# Altium schematic sheet tinynano.SchDoc
size A2
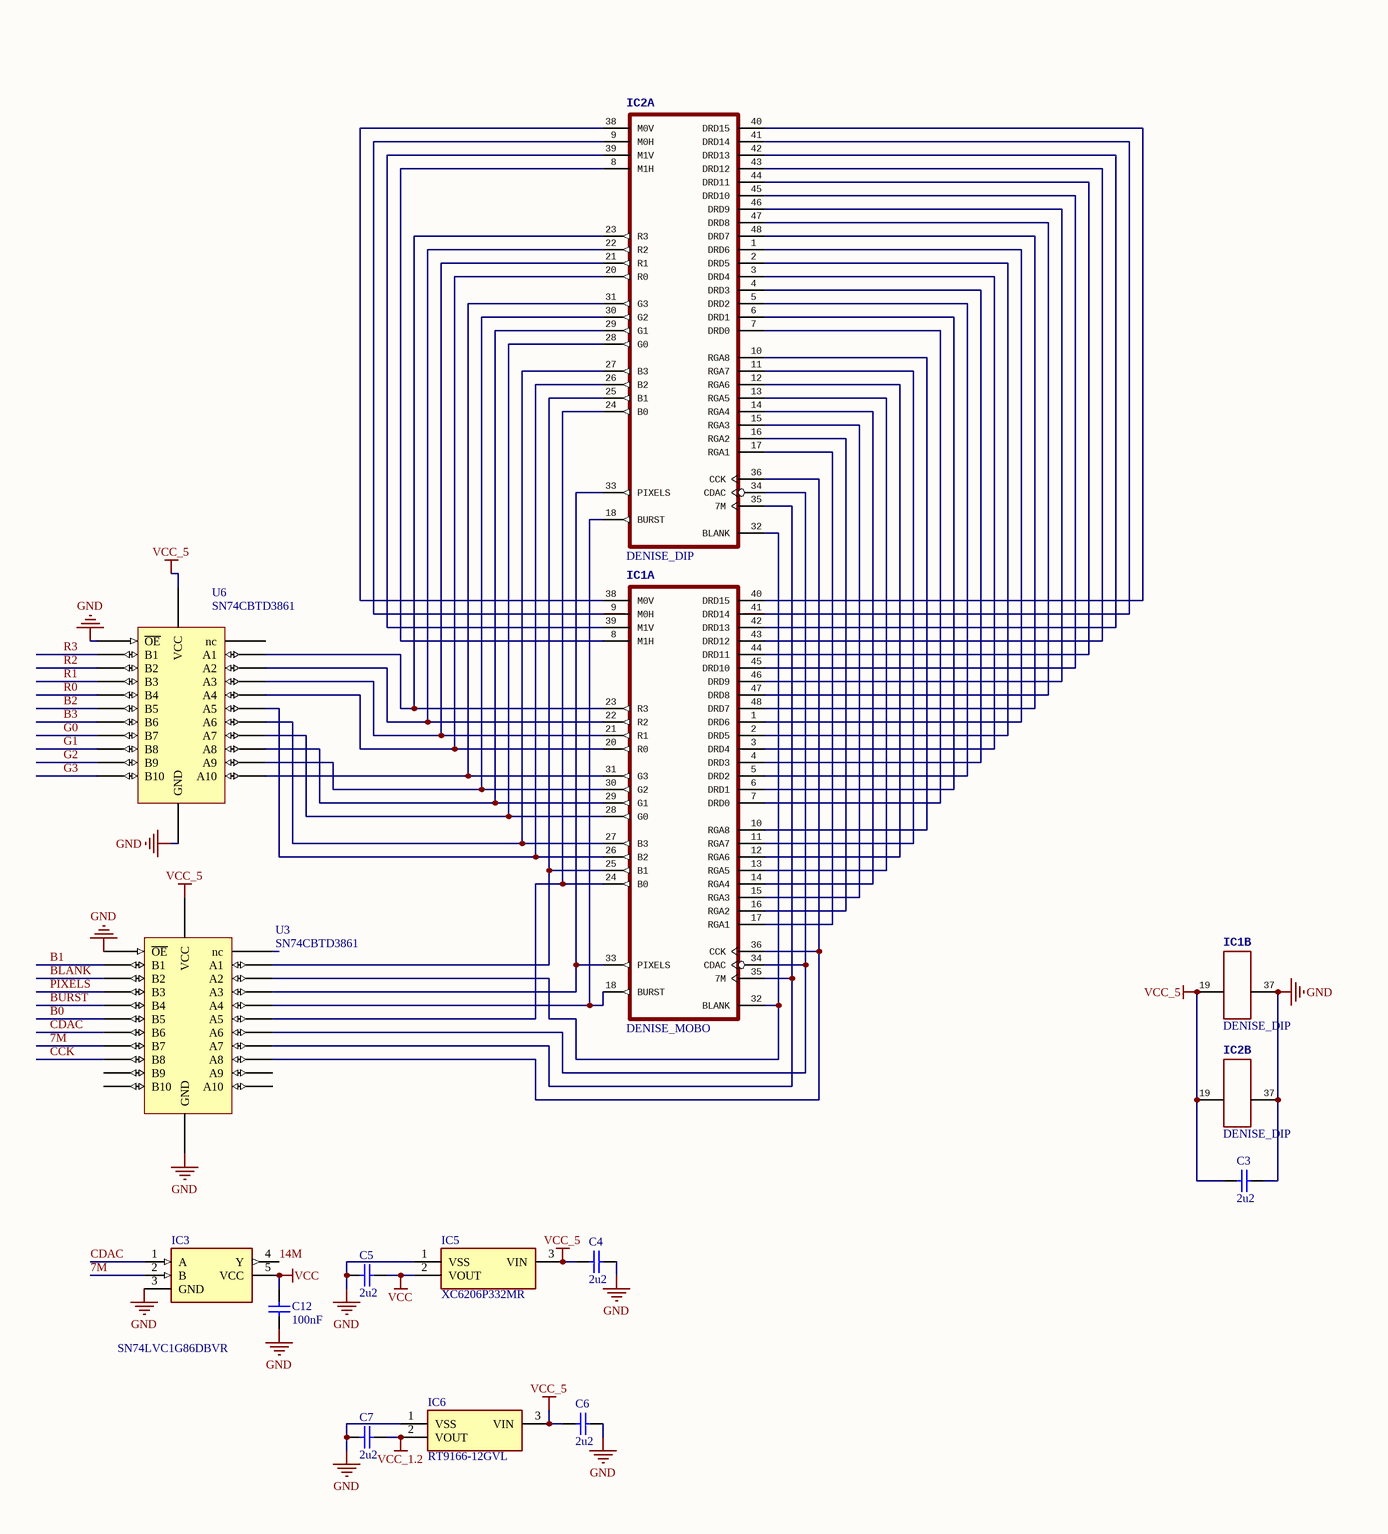
[diagram p0: tinynano.SchDoc, left]
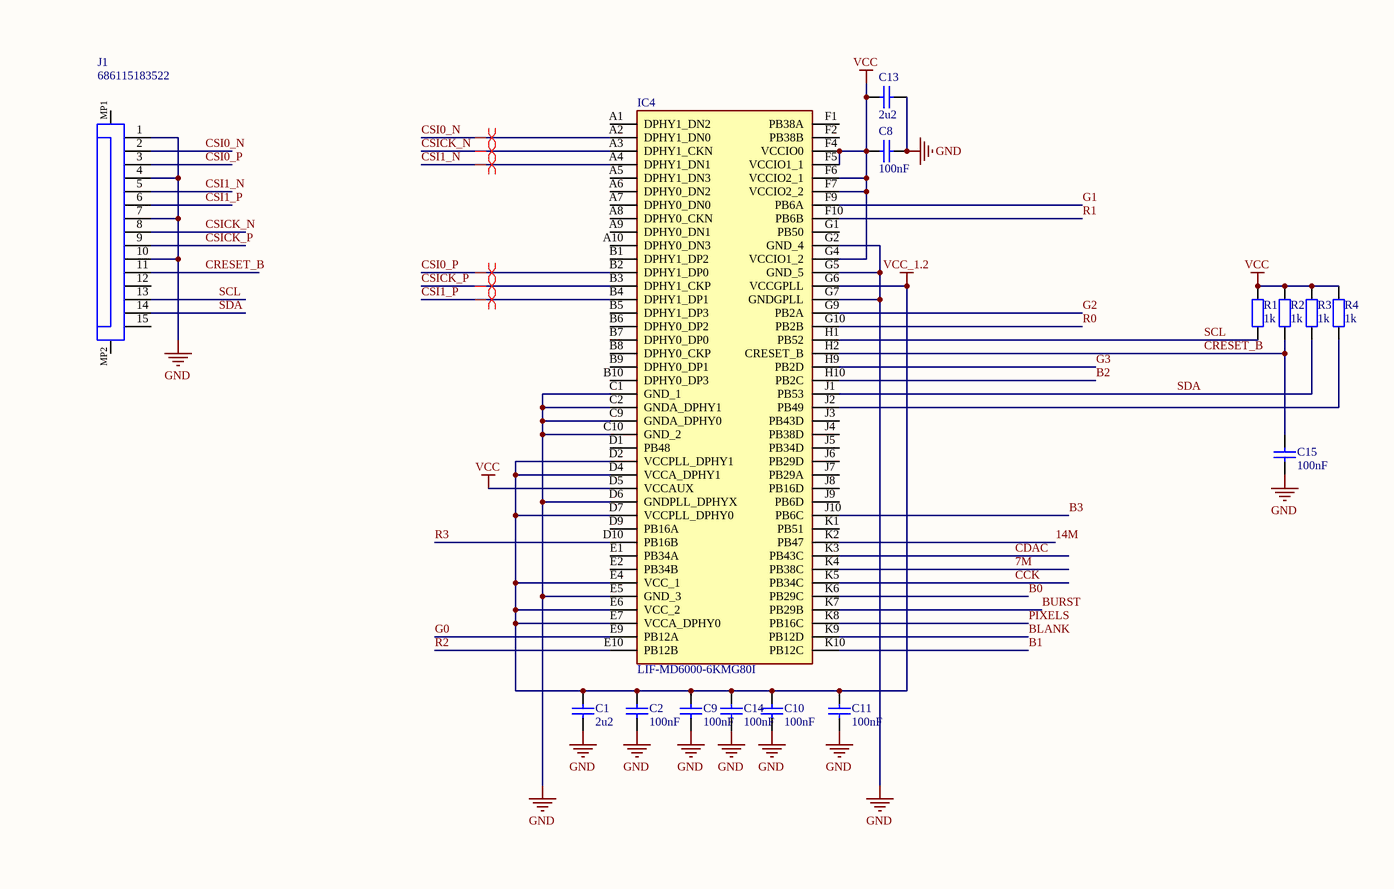
[diagram p1: tinynano.SchDoc, right]

## Parts
C1  value 2u2  [1608[0603]]  (hidden comment: Cap Semi)
C2  value 100nF  [0402]  (hidden comment: Cap Semi)
C3  value 2u2  [1608[0603]]  (hidden comment: Cap Semi)
C4  value 2u2  [1608[0603]]  (hidden comment: Cap Semi)
C5  value 2u2  [1608[0603]]  (hidden comment: Cap Semi)
C6  value 2u2  [1608[0603]]  (hidden comment: Cap Semi)
C7  value 2u2  [1608[0603]]  (hidden comment: Cap Semi)
C8  value 100nF  [0402]  (hidden comment: Cap Semi)
C9  value 100nF  [0402]  (hidden comment: Cap Semi)
C10  value 100nF  [0402]  (hidden comment: Cap Semi)
C11  value 100nF  [0402]  (hidden comment: Cap Semi)
C12  value 100nF  [0402]  (hidden comment: Cap Semi)
C13  value 2u2  [1608[0603]]  (hidden comment: Cap Semi)
C14  value 100nF  [1608[0603]]  (hidden comment: Cap Semi)
C15  value 100nF  [0402]  (hidden comment: Cap Semi)
IC1  DENISE_MOBO  [DIP48-6]  (parts A,B of 2)
IC2  DENISE_DIP  [DIP48-6]  (parts A,B of 2)
IC3  SN74LVC1G86DBVR  [SOT95P280X145-5N]
IC4  LIF-MD6000-6KMG80I  [BGA80C65P10X10_700X700X120]
IC5  XC6206P332MR  [SOT95P280X130-3N]
IC6  RT9166-12GVL  [SOT95P280X130-3N]
J1  686115183522  [686115183522]
R1  value 1k  [0402-A]  (hidden comment: Res2)
R2  value 1k  [0402-A]  (hidden comment: Res2)
R3  value 1k  [0402-A]  (hidden comment: Res2)
R4  value 1k  [0402-A]  (hidden comment: Res2)
U3  SN74CBTD3861  [DB024]
U6  SN74CBTD3861  [DB024]

## Nets
GND: C1.2 C2.1 C3.1 C4.1 C5.2 C6.1 C7.2 C8.1 C9.1 C10.1 C11.1 C12.1 C13.2 C14.1 C15.1 IC1.37(GND1) IC2.37(GND1) IC3.3(GND) IC4.C1(GND_1) IC4.C2(GNDA_DPHY1) IC4.C9(GNDA_DPHY0) IC4.C10(GND_2) IC4.D6(GNDPLL_DPHYX) IC4.E5(GND_3) IC4.G2(GND_4) IC4.G5(GND_5) IC4.G7(GNDGPLL) IC5.1(VSS) IC6.1(VSS) J1.1 J1.4 J1.7 J1.10 U3.12(GND) U3.23(~{OE}) U6.12(GND) U6.23(~{OE})
VCC: C5.1 C8.2 C12.2 C13.1 IC3.5(VCC) IC4.D5(VCCAUX) IC4.F4(VCCIO0) IC4.F5(VCCIO1_1) IC4.F6(VCCIO2_1) IC4.F7(VCCIO2_2) IC4.G4(VCCIO1_2) IC5.2(VOUT) R1.1 R2.1 R3.1 R4.1
VCC_1.2: C1.1 C2.2 C7.1 C9.2 C10.2 C11.2 C14.2 IC4.D2(VCCPLL_DPHY1) IC4.D4(VCCA_DPHY1) IC4.D7(VCCPLL_DPHY0) IC4.E4(VCC_1) IC4.E6(VCC_2) IC4.E7(VCCA_DPHY0) IC4.G6(VCCGPLL) IC6.2(VOUT)
VCC_5: C3.2 C4.2 C6.2 IC1.19(VCC1) IC2.19(VCC1) IC5.3(VIN) IC6.3(VIN) U3.24(VCC) U6.24(VCC)
7M: IC3.2(B) IC4.K4(PB38C) U3.16(B7)
14M: IC3.4(Y) IC4.K2(PB47)
B0: IC4.K6(PB29C) U3.18(B5)
B1: IC4.K10(PB12C) U3.22(B1)
B2: IC4.H10(PB2C) U6.18(B5)
B3: IC4.J10(PB6C) U6.17(B6)
BLANK: IC4.K9(PB12D) U3.21(B2)
BURST: IC4.K7(PB29B) U3.19(B4)
CCK: IC4.K5(PB34C) U3.15(B8)
CDAC: IC3.1(A) IC4.K3(PB43C) U3.17(B6)
CRESET_B: C15.2 IC4.H2(CRESET_B) J1.11 R2.2
CSI0_N: IC4.A2(DPHY1_DN0) J1.2
CSI0_P: IC4.B2(DPHY1_DP0) J1.3
CSI1_N: IC4.A4(DPHY1_DN1) J1.5
CSI1_P: IC4.B4(DPHY1_DP1) J1.6
CSICK_N: IC4.A3(DPHY1_CKN) J1.8
CSICK_P: IC4.B3(DPHY1_CKP) J1.9
G0: IC4.E9(PB12A) U6.16(B7)
G1: IC4.F9(PB6A) U6.15(B8)
G2: IC4.G9(PB2A) U6.14(B9)
G3: IC4.H9(PB2D) U6.13(B10)
PIXELS: IC4.K8(PB16C) U3.20(B3)
R0: IC4.G10(PB2B) U6.19(B4)
R1: IC4.F10(PB6B) U6.20(B3)
R2: IC4.E10(PB12B) U6.21(B2)
R3: IC4.D10(PB16B) U6.22(B1)
SCL: IC4.H1(PB52) J1.13 R1.2
SDA: IC4.J1(PB53) J1.14 R3.2
NetIC1_1: IC1.1(DRD6) IC2.1(DRD6)
NetIC1_2: IC1.2(DRD5) IC2.2(DRD5)
NetIC1_3: IC1.3(DRD4) IC2.3(DRD4)
NetIC1_4: IC1.4(DRD3) IC2.4(DRD3)
NetIC1_5: IC1.5(DRD2) IC2.5(DRD2)
NetIC1_6: IC1.6(DRD1) IC2.6(DRD1)
NetIC1_7: IC1.7(DRD0) IC2.7(DRD0)
NetIC1_8: IC1.8(M1H) IC2.8(M1H)
NetIC1_9: IC1.9(M0H) IC2.9(M0H)
NetIC1_10: IC1.10(RGA8) IC2.10(RGA8)
NetIC1_11: IC1.11(RGA7) IC2.11(RGA7)
NetIC1_12: IC1.12(RGA6) IC2.12(RGA6)
NetIC1_13: IC1.13(RGA5) IC2.13(RGA5)
NetIC1_14: IC1.14(RGA4) IC2.14(RGA4)
NetIC1_15: IC1.15(RGA3) IC2.15(RGA3)
NetIC1_16: IC1.16(RGA2) IC2.16(RGA2)
NetIC1_17: IC1.17(RGA1) IC2.17(RGA1)
NetIC1_18: IC1.18(BURST) IC2.18(BURST) U3.5(A4)
NetIC1_20: IC1.20(R0) IC2.20(R0) U6.5(A4)
NetIC1_21: IC1.21(R1) IC2.21(R1) U6.4(A3)
NetIC1_22: IC1.22(R2) IC2.22(R2) U6.3(A2)
NetIC1_23: IC1.23(R3) IC2.23(R3) U6.2(A1)
NetIC1_24: IC1.24(B0) IC2.24(B0) U3.6(A5)
NetIC1_25: IC1.25(B1) IC2.25(B1) U3.2(A1)
NetIC1_26: IC1.26(B2) IC2.26(B2) U6.6(A5)
NetIC1_27: IC1.27(B3) IC2.27(B3) U6.7(A6)
NetIC1_28: IC1.28(G0) IC2.28(G0) U6.8(A7)
NetIC1_29: IC1.29(G1) IC2.29(G1) U6.9(A8)
NetIC1_30: IC1.30(G2) IC2.30(G2) U6.10(A9)
NetIC1_31: IC1.31(G3) IC2.31(G3) U6.11(A10)
NetIC1_32: IC1.32(BLANK) IC2.32(BLANK) U3.3(A2)
NetIC1_33: IC1.33(PIXELS) IC2.33(PIXELS) U3.4(A3)
NetIC1_34: IC1.34(CDAC) IC2.34(CDAC) U3.7(A6)
NetIC1_35: IC1.35(7M) IC2.35(7M) U3.8(A7)
NetIC1_36: IC1.36(CCK) IC2.36(CCK) U3.9(A8)
NetIC1_38: IC1.38(M0V) IC2.38(M0V)
NetIC1_39: IC1.39(M1V) IC2.39(M1V)
NetIC1_40: IC1.40(DRD15) IC2.40(DRD15)
NetIC1_41: IC1.41(DRD14) IC2.41(DRD14)
NetIC1_42: IC1.42(DRD13) IC2.42(DRD13)
NetIC1_43: IC1.43(DRD12) IC2.43(DRD12)
NetIC1_44: IC1.44(DRD11) IC2.44(DRD11)
NetIC1_45: IC1.45(DRD10) IC2.45(DRD10)
NetIC1_46: IC1.46(DRD9) IC2.46(DRD9)
NetIC1_47: IC1.47(DRD8) IC2.47(DRD8)
NetIC1_48: IC1.48(DRD7) IC2.48(DRD7)
NetIC4_J2: IC4.J2(PB49) R4.2

Not connected (* = marked no-connect by the designer): IC4 A1(DPHY1_DN2) A5(DPHY1_DN3) A6(DPHY0_DN2) A7(DPHY0_DN0) A8(DPHY0_CKN) A9(DPHY0_DN1) A10(DPHY0_DN3) B1(DPHY1_DP2) B5(DPHY1_DP3) B6(DPHY0_DP2) B7(DPHY0_DP0) B8(DPHY0_CKP) B9(DPHY0_DP1) B10(DPHY0_DP3) D1(PB48) D9(PB16A) E1(PB34A) E2(PB34B) F1(PB38A) F2(PB38B) G1(PB50) J3(PB43D) J4(PB38D) J5(PB34D) J6(PB29D) J7(PB29A) J8(PB16D) J9(PB6D) K1(PB51); J1 12 15 MP1 MP2; U3 1(nc) 10(A9) 11(A10) 13(B10) 14(B9); U6 1(nc)

## Layout directives
differential pair: CSI0_N, CSI0_P, CSI1_N, CSI1_P, CSICK_N, CSICK_P

## Library data of the parts
C1-C15 = Cap Semi: Capacitor (Semiconductor SIM Model); Published: 8-Jun-2000; LatestRevisionDate: 29-May-2009; LatestRevisionNote: IPC-7351 Footprint Added.; PackageReference: C1206; Publisher: Altium Limited; PackageDescription: Chip Capacitor
IC1 = DENISE_DIP
IC3 = SN74LVC1G86DBVR: Integrated Circuit; Manufacturer_Name: Texas Instruments; Datasheet Link: http://www.ti.com/lit/ds/symlink/sn74lvc1g86.pdf; Height: 1.45mm; Manufacturer_Part_Number: SN74LVC1G86DBVR; Mouser Part Number: 595-SN74LVC1G86DBVR; Mouser Price/Stock: https://www.mouser.co.uk/ProductDetail/Texas-Instruments/SN74LVC1G86DBVR/?qs=d9gICRQKuCcyH%2F0J6yE9tQ%3D%3D; Arrow Part Number: SN74LVC1G86DBVR; Arrow Price/Stock: https://www.arrow.com/en/products/sn74lvc1g86dbvr/texas-instruments
IC4 = LIF-MD6000-6KMG80I: Integrated Circuit; Manufacturer_Name: Lattice Semiconductor; Datasheet Link: http://www.latticesemi.com/view_document?document_id=51662; Height: 1.2mm; Manufacturer_Part_Number: LIF-MD6000-6KMG80I; Mouser Part Number: 842-LIFMD60006KMG80I; Mouser Price/Stock: https://www.mouser.co.uk/ProductDetail/Lattice/LIF-MD6000-6KMG80I/?qs=F5EMLAvA7IDEfdUebejsLA%3D%3D; Arrow Part Number: LIF-MD6000-6KMG80I; Arrow Price/Stock: https://www.arrow.com/en/products/lif-md6000-6kmg80i/lattice-semiconductor
IC5 IC6 = XC6206P332MR: Integrated Circuit; Manufacturer_Name: Torex; Datasheet Link: http://www.torexsemi.com/products/voltage_regulators/data/XC6206.pdf; Height: 1.3mm; Manufacturer_Part_Number: XC6206P332MR
J1 = 686115183522: WR-FPC SMT ZIF Horizontal Bottom Contact Low Profile, pitch 1mm, 15p; Manufacturer: Wurth Elektronik; Contact Resistance: 30mOhm; Pin Number: 15; Working Voltage: 50VAC; Rated Current: 0.8A; ComponentLink1Description: Manufacturer; ComponentLink1URL: http://www.we-online.de; ComponentLink2Description: Datasheet; ComponentLink2URL: https://katalog.we-online.com/em/datasheet/686115183522.pdf; Packaging: Tape and Reel; Pitch: 1mm; Published Date: March 2021; Mounting Technology: SMT; Operating Temperature: -25 to +85degC; Length: 21.2mm; Manufacturer Part Number: 686115183522; Type: Horizontal
R1-R4 = Res2: Resistor; Published: 8-Jun-2000; LatestRevisionDate: 17-Jul-2002; LatestRevisionNote: Re-released for DXP Platform.; PackageReference: AXIAL-0.4; Publisher: Altium Limited; PackageDescription: Axial Device, Thru-Hole; 2 Leads; 0.4 in Pin Spacing
U3 U6 = SN74CBTD3861: 10-bit FET bus level shifting switch